# Altium project STM32F446_Nucleo_DSP_Backpack.PrjPcb
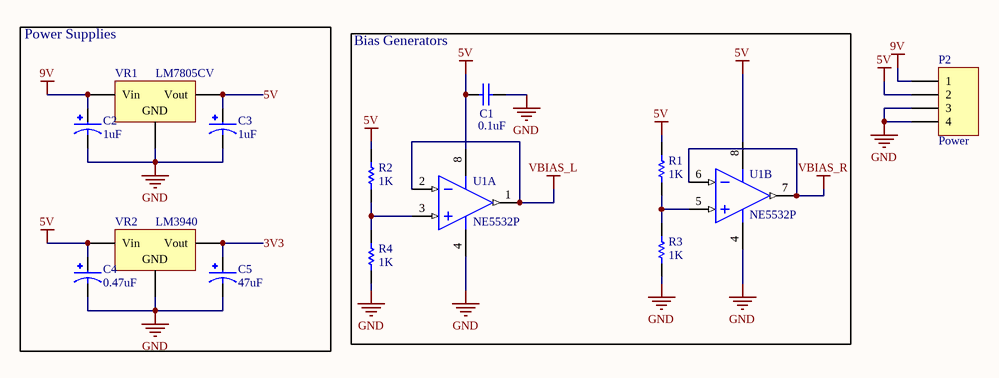
[diagram p0: Power.SchDoc]
3 sheets, 91 parts. Net scope: global (net labels, ports and power ports of the same name join across sheets).
Board file: PCB1.PcbDoc
Sheets:
  Power.SchDoc
  Volume_Tone_Control.SchDoc
  Digital.SchDoc

## Sheet Power.SchDoc
size Letter; SheetNumber: 1; SheetTotal: 3

### Parts
C1  value 0.1uF  [RAD-0.1]  (hidden comment: Cap)
C2  1uF  [CAPPRD200W50D500H1500]
C3  1uF  [CAPPRD200W50D500H1500]
C4  0.47uF  [CAPPRD200W50D500H1500]
C5  47uF  [CAPPRD200W50D500H1500]
P2  Power  [HDR1X4]
R1  value 1K  [AXIAL-0.3]  (hidden comment: Res1)
R2  value 1K  [AXIAL-0.3]  (hidden comment: Res1)
R3  value 1K  [AXIAL-0.3]  (hidden comment: Res1)
R4  value 1K  [AXIAL-0.3]  (hidden comment: Res1)
U1  NE5532P  [TI-P8]  (parts A,B of 2)
VR1  LM7805CV  [T03B]
VR2  LM3940  [T03B]

### Blocks framed on the sheet
Power Supplies: C2-C5 VR1 VR2
Bias Generators: C1 R1-R4 U1

### Nets
3V3: C5.P VR2.3(Vout)
5V: C1.1 C3.P C4.P P2.2 R1.2 R2.2 U1.8(VCC+) VR1.3(Vout) VR2.1(Vin)
9V: C2.P P2.1 VR1.1(Vin)
GND: C1.2 C2.N C3.N C4.N C5.N P2.3 P2.4 R3.1 R4.1 U1.4(VCC-) VR1.2(GND) VR2.2(GND)
VBIAS_L: U1.1(OUT1) U1.2(IN1-)
VBIAS_R: U1.6(IN2-) U1.7(OUT2)
NetR1_1: R1.1 R3.2 U1.5(IN2+)
NetR2_1: R2.1 R4.2 U1.3(IN1+)

### Library data of the parts
C1 = Cap: Capacitor; Published: 8-Jun-2000; LatestRevisionDate: 17-Jul-2002; LatestRevisionNote: Re-released for DXP Platform.; PackageReference: RAD-0.3; Publisher: Altium Limited; PackageDescription: Radial Cap, Thru-Hole; 2 Leads; 0.3 in Pin Spacing
C2-C5 = EEUEB1J1R0: 1F 63V Aluminum Electrolytic Capacitors Radial, Can 5000 Hrs @ 105C; MP: EEU-EB1J1R0; MF: Panasonic Electronic Components; Price: None; Value: *; Package: RADIAL-2 Panasonic; Check_prices: https://www.snapeda.com/parts/EEU-EB1J1R0/Panasonic/view-part/6221748/?ref=eda; SnapEDA_Link: https://www.snapeda.com/parts/EEU-EB1J1R0/Panasonic/view-part/6221748/?ref=snap; Availability: Not in stock
P2 = Header 4: Header, 4-Pin; LatestRevisionDate: 17-Jul-2002; LatestRevisionNote: Re-released for DXP Platform.; Publisher: Altium Limited
R1-R4 = Res1: Resistor; Published: 8-Jun-2000; LatestRevisionDate: 17-Jul-2002; LatestRevisionNote: Re-released for DXP Platform.; PackageReference: AXIAL-0.3; Publisher: Altium Limited; PackageDescription: Axial Device, Thru-Hole; 2 Leads; 0.3 in Pin Spacing
U1 = NE5532P: Dual Low-Noise High-Speed Audio Operational Amplifier, 10 to 30 V, 0 to 70 degC, 8-pin DIP (P8), Pb-Free (RoHS); Manufacturer: Texas Instruments; Slew Rate(Typ)(V/us): 9; CMRR(Min)(dB): 70; Sub Family: General Purpose Amplifier, High Supply Voltage Amplifier (>=30V), Low Noise Amp (<=10nV/rtHz); IIB(Max)(pA): 800000; GBW(Typ)(MHz): 10; Iq per channel(Max)(mA): 4; Number of Channels: 2; Vn at 1kHz(Typ)(nV/rtHz): 5; Total Supply Voltage(Max)(+5V is 5, +/-5V is 10): 30; Eco-Plan: Pb-Free (RoHS); PartNumber: NE5532P; ComponentLink1Description: Manufacturer URL; ComponentLink2Description: Datasheet; DatasheetVersion: SLOS075I; ComponentLink3URL: http://www.ti.com/litv/pdf/mpdi001b; ComponentLink1URL: http://www.ti.com/; Code_JEDEC: MS-001; Total Supply Voltage(Min)(+5V is 5, +/-5V is 10): 10; ComponentLink2URL: http://www.ti.com/lit/ds/symlink/ne5532.pdf; PackageReference: P8; ComponentLink3Description: Package Specification; Vio (25C)(Max)(mV): 4; PackageVersion: 4040082/E, 04/2010; Mounting Technology: Through Hole; PackageDescription: 8-Pin Plastic In-Line, Body 9.59 x 6.35 mm, Pitch 2.54 mm
VR1 VR2 = Volt Reg: Voltage Regulator; Published: 24-Mar-1999; LatestRevisionDate: 29-May-2009; LatestRevisionNote: IPC-7351 Footprint Added.; PackageReference: D2PAK; Publisher: Altium Limited; PackageDescription: 3-Pin Transistor Outline Package 2.54 mm Pitch, 15.1 mm Lead Span

## Sheet Volume_Tone_Control.SchDoc
size Letter; SheetNumber: 2; SheetTotal: 3
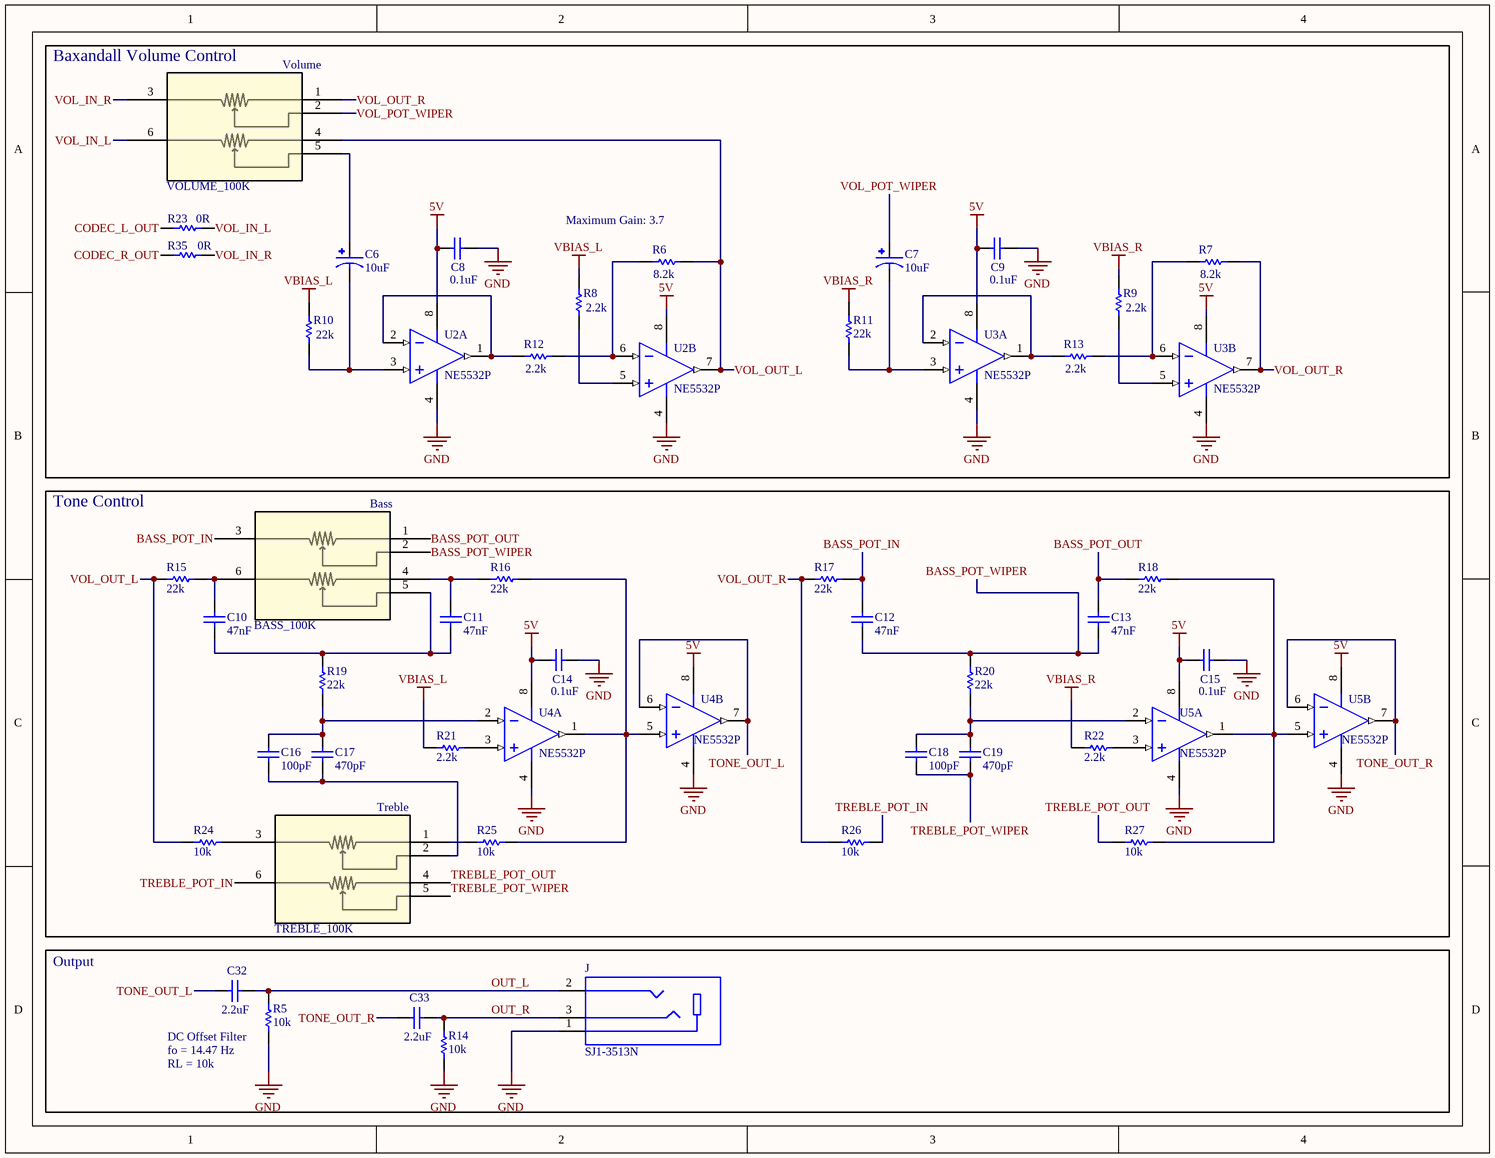
[diagram p1: Volume_Tone_Control.SchDoc]

### Parts
Bass  BASS_100K  [Bourns_PDB182-K425K-103A_0]
C6  10uF  [CAPPRD200W50D500H1500]
C7  10uF  [CAPPRD200W50D500H1500]
C8  value 0.1uF  [RAD-0.1]  (hidden comment: Cap)
C9  value 0.1uF  [RAD-0.1]  (hidden comment: Cap)
C10  value 47nF  [RAD-0.1]  (hidden comment: Cap)
C11  value 47nF  [RAD-0.1]  (hidden comment: Cap)
C12  value 47nF  [RAD-0.1]  (hidden comment: Cap)
C13  value 47nF  [RAD-0.1]  (hidden comment: Cap)
C14  value 0.1uF  [RAD-0.1]  (hidden comment: Cap)
C15  value 0.1uF  [RAD-0.1]  (hidden comment: Cap)
C16  value 100pF  [RAD-0.1]  (hidden comment: Cap)
C17  value 470pF  [RAD-0.1]  (hidden comment: Cap)
C18  value 100pF  [RAD-0.1]  (hidden comment: Cap)
C19  value 470pF  [RAD-0.1]  (hidden comment: Cap)
C32  value 2.2uF  [RAD-0.1]  (hidden comment: Cap)
C33  value 2.2uF  [RAD-0.1]  (hidden comment: Cap)
J  SJ1-3513N  [CUI_SJ1-3513N]
R5  value 10k  [AXIAL-0.3]  (hidden comment: Res1)
R6  value 8.2k  [AXIAL-0.3]  (hidden comment: Res1)
R7  value 8.2k  [AXIAL-0.3]  (hidden comment: Res1)
R8  value 2.2k  [AXIAL-0.3]  (hidden comment: Res1)
R9  value 2.2k  [AXIAL-0.3]  (hidden comment: Res1)
R10  value 22k  [AXIAL-0.3]  (hidden comment: Res1)
R11  value 22k  [AXIAL-0.3]  (hidden comment: Res1)
R12  value 2.2k  [AXIAL-0.3]  (hidden comment: Res1)
R13  value 2.2k  [AXIAL-0.3]  (hidden comment: Res1)
R14  value 10k  [AXIAL-0.3]  (hidden comment: Res1)
R15  value 22k  [AXIAL-0.3]  (hidden comment: Res1)
R16  value 22k  [AXIAL-0.3]  (hidden comment: Res1)
R17  value 22k  [AXIAL-0.3]  (hidden comment: Res1)
R18  value 22k  [AXIAL-0.3]  (hidden comment: Res1)
R19  value 22k  [AXIAL-0.3]  (hidden comment: Res1)
R20  value 22k  [AXIAL-0.3]  (hidden comment: Res1)
R21  value 2.2k  [AXIAL-0.3]  (hidden comment: Res1)
R22  value 2.2k  [AXIAL-0.3]  (hidden comment: Res1)
R23  value 0R  [AXIAL-0.3]  (hidden comment: Res1)
R24  value 10k  [AXIAL-0.3]  (hidden comment: Res1)
R25  value 10k  [AXIAL-0.3]  (hidden comment: Res1)
R26  value 10k  [AXIAL-0.3]  (hidden comment: Res1)
R27  value 10k  [AXIAL-0.3]  (hidden comment: Res1)
R35  value 0R  [AXIAL-0.3]  (hidden comment: Res1)
Treble  TREBLE_100K  [Bourns_PDB182-K425K-103A_0]
U2  NE5532P  [TI-P8]  (parts A,B of 2)
U3  NE5532P  [TI-P8]  (parts A,B of 2)
U4  NE5532P  [TI-P8]  (parts A,B of 2)
U5  NE5532P  [TI-P8]  (parts A,B of 2)
Volume  VOLUME_100K  [PDB-182-K_20K_BRN]

### Blocks framed on the sheet
Baxandall Volume Control: C6-C9 R6-R13 R23 R35 U2 U3 Volume
Tone Control: Bass C10-C19 R15-R22 R24-R27 Treble U4 U5
Output: C32 C33 J R5 R14

### Nets
5V: C8.1 C9.1 C14.1 C15.1 U2.8(VCC+) U3.8(VCC+) U4.8(VCC+) U5.8(VCC+)
GND: C8.2 C9.2 C14.2 C15.2 J.1 R5.2 R14.2 U2.4(VCC-) U3.4(VCC-) U4.4(VCC-) U5.4(VCC-)
VBIAS_L: R8.1 R10.1 R21.1
VBIAS_R: R9.1 R11.1 R22.1
BASS_POT_IN: Bass.3 C12.1 R17.2
BASS_POT_OUT: Bass.1 C13.1 R18.1
BASS_POT_WIPER: Bass.2 C12.2 C13.2 R20.2
CODEC_L_OUT: R23.1
CODEC_R_OUT: R35.1
OUT_L: C32.1 J.2 R5.1
OUT_R: C33.1 J.3 R14.1
TONE_OUT_L: C32.2 U4.6(IN2-) U4.7(OUT2)
TONE_OUT_R: C33.2 U5.6(IN2-) U5.7(OUT2)
TREBLE_POT_IN: R26.2 Treble.6
TREBLE_POT_OUT: R27.2 Treble.4
TREBLE_POT_WIPER: C18.1 C19.1 Treble.5
VOL_IN_L: R23.2 Volume.6
VOL_IN_R: R35.2 Volume.3
VOL_OUT_L: R6.2 R15.1 R24.1 U2.7(OUT2) Volume.4
VOL_OUT_R: R7.2 R17.1 R26.1 U3.7(OUT2) Volume.1
VOL_POT_WIPER: C7.P Volume.2
NetBass_4: Bass.4 C11.1 R16.1
NetBass_5: Bass.5 C10.2 C11.2 R19.2
NetBass_6: Bass.6 C10.1 R15.2
NetC6_N: C6.N R10.2 U2.3(IN1+)
NetC6_P: C6.P Volume.5
NetC7_N: C7.N R11.2 U3.3(IN1+)
NetC16_1: C16.1 C17.1 Treble.2
NetC16_2: C16.2 C17.2 R19.1 U4.2(IN1-)
NetC18_2: C18.2 C19.2 R20.1 U5.2(IN1-)
NetR6_1: R6.1 R12.2 U2.6(IN2-)
NetR7_1: R7.1 R13.2 U3.6(IN2-)
NetR8_2: R8.2 U2.5(IN2+)
NetR9_2: R9.2 U3.5(IN2+)
NetR12_1: R12.1 U2.1(OUT1) U2.2(IN1-)
NetR13_1: R13.1 U3.1(OUT1) U3.2(IN1-)
NetR16_2: R16.2 R25.1 U4.1(OUT1) U4.5(IN2+)
NetR18_2: R18.2 R27.1 U5.1(OUT1) U5.5(IN2+)
NetR21_2: R21.2 U4.3(IN1+)
NetR22_2: R22.2 U5.3(IN1+)
NetR24_2: R24.2 Treble.3
NetR25_2: R25.2 Treble.1

### Notes on the sheet
- (near R6) Maximum Gain: 3.7
- (near R5) DC Offset Filter
- (near R5) fo = 14.47 Hz
- RL = 10k

### Library data of the parts
Bass Treble Volume = PDB182-K420K-103A2: No Description Available; Mfr_Name: Bourns Electronics; Copyright: Copyright (C) 2022 Ultra Librarian. All rights reserved.; Manufacturer_Part_Number: PDB182-K420K-103A2; RefDes: RefDes; Type: DEV
C6 C7 = EEUFC1J101: Capacitor; Aluminum Electrolytic; Radial Al Electrolytic Cap; 100uF 63V; MF: Panasonic Electronic; MP: EEU-FC1J101; Package: RADIAL-2 Panasonic; Price: None; Check_prices: https://www.snapeda.com/parts/EEU-FC1J101/Panasonic%20Electronic%20Components/view-part/494707/?ref=eda; Value: *; SnapEDA_Link: https://www.snapeda.com/parts/EEU-FC1J101/Panasonic%20Electronic%20Components/view-part/494707/?ref=snap; Availability: In Stock
C8-C19 C32 C33 = Cap: Capacitor; Published: 8-Jun-2000; LatestRevisionDate: 17-Jul-2002; LatestRevisionNote: Re-released for DXP Platform.; PackageReference: RAD-0.3; Publisher: Altium Limited; PackageDescription: Radial Cap, Thru-Hole; 2 Leads; 0.3 in Pin Spacing
J = SJ1-3513N: 3.5 mm, Stereo, Right Angle, Through Hole, Audio Jack Connector; MF: CUI Devices; Package: None; CUI_purchase_URL: https://www.cuidevices.com/product/interconnect/connectors/audio-connectors/jacks/sj1-351xn-series?utm_source=snapeda.com&utm_medium=referral&utm_campaign=snapedaBOM; Value: *; Price: None; MP: SJ1-3513N; Availability: Unavailable; SnapEDA_Link: https://www.snapeda.com/parts/SJ1-3513N/CUI%20Devices/view-part/617507/?ref=snap
R5-R27 R35 = Res1: Resistor; Published: 8-Jun-2000; LatestRevisionDate: 17-Jul-2002; LatestRevisionNote: Re-released for DXP Platform.; PackageReference: AXIAL-0.3; Publisher: Altium Limited; PackageDescription: Axial Device, Thru-Hole; 2 Leads; 0.3 in Pin Spacing
U2-U5 = NE5532P: as U1 on sheet Power; Eco-Plan: Pb-Free (RoHS); PartNumber: NE5532P; ComponentLink1Description: Manufacturer URL; ComponentLink2Description: Datasheet; DatasheetVersion: SLOS075I; ComponentLink3URL: http://www.ti.com/litv/pdf/mpdi001b; ComponentLink1URL: http://www.ti.com/; Code_JEDEC: MS-001; Total Supply Voltage(Min)(+5V is 5, +/-5V is 10): 10; ComponentLink2URL: http://www.ti.com/lit/ds/symlink/ne5532.pdf; PackageReference: P8; ComponentLink3Description: Package Specification; Vio (25C)(Max)(mV): 4; PackageVersion: 4040082/E, 04/2010; Mounting Technology: Through Hole; PackageDescription: 8-Pin Plastic In-Line, Body 9.59 x 6.35 mm, Pitch 2.54 mm

## Sheet Digital.SchDoc
size Letter; SheetNumber: 3; SheetTotal: 3
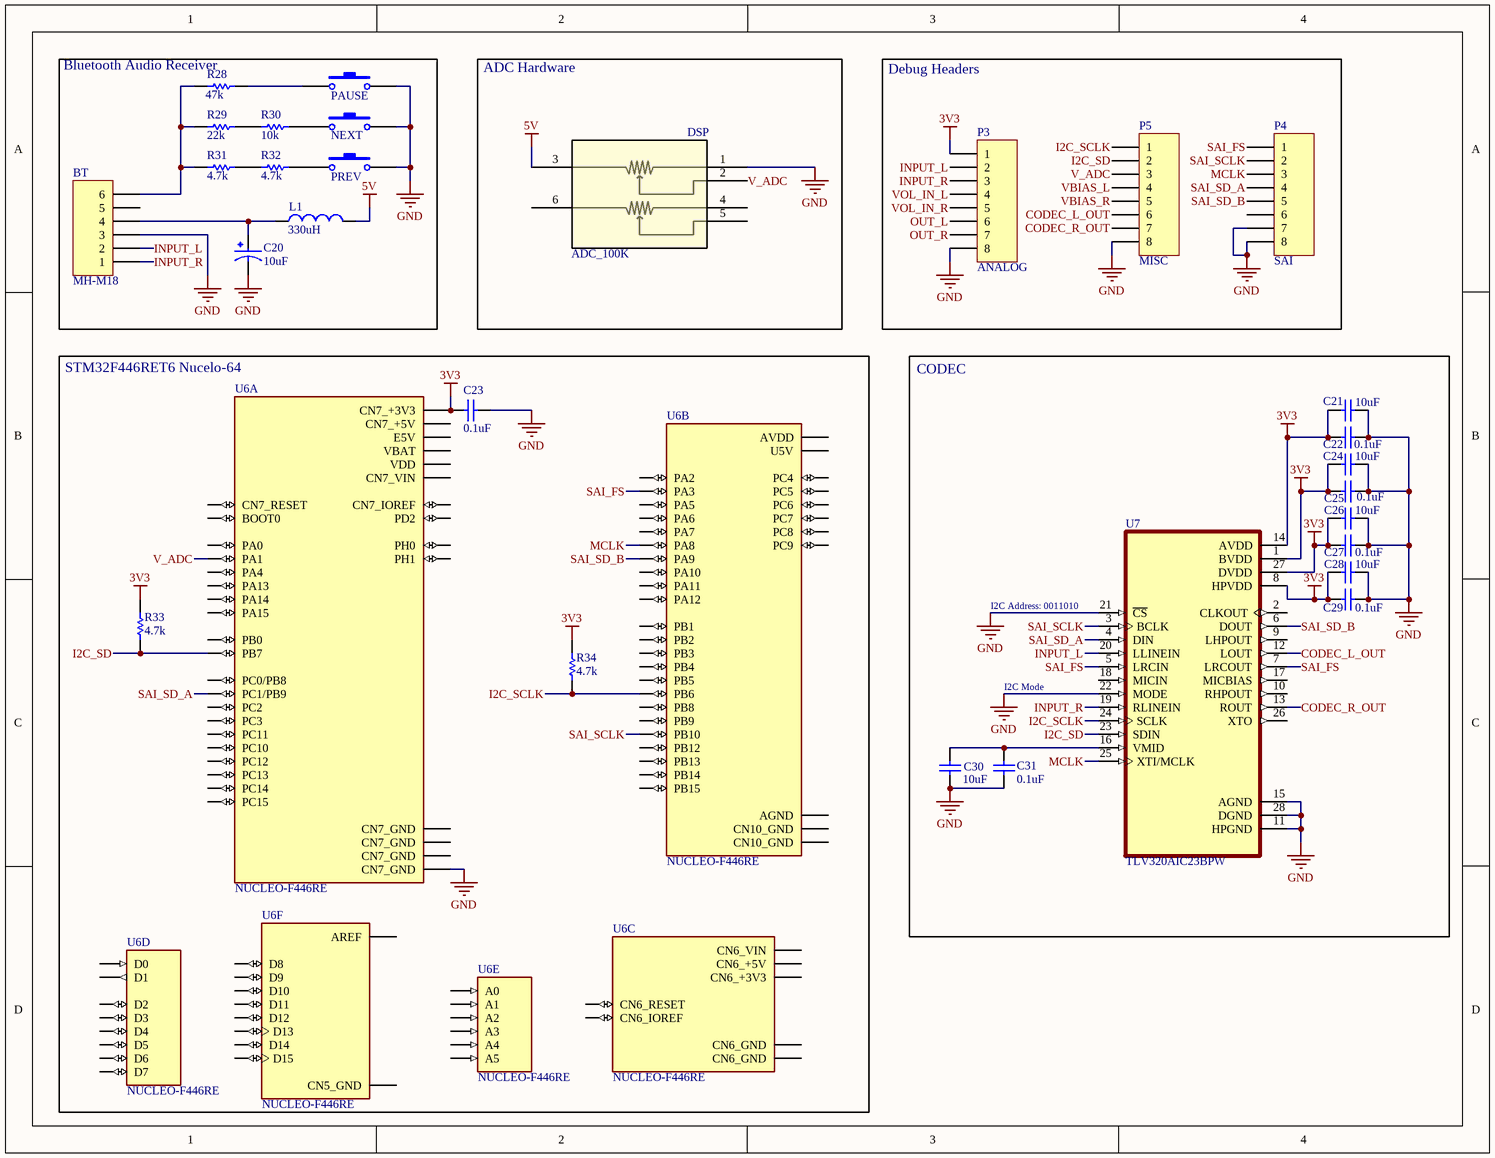
[diagram p2: Digital.SchDoc]

### Parts
BT  MH-M18  [HDR1X6]
C20  10uF  [CAPPRD200W50D500H1500]
C21  value 10uF  [RAD-0.1]  (hidden comment: Cap)
C22  value 0.1uF  [RAD-0.1]  (hidden comment: Cap)
C23  value 0.1uF  [RAD-0.1]  (hidden comment: Cap)
C24  value 10uF  [RAD-0.1]  (hidden comment: Cap)
C25  value 0.1uF  [RAD-0.1]  (hidden comment: Cap)
C26  value 10uF  [RAD-0.1]  (hidden comment: Cap)
C27  value 0.1uF  [RAD-0.1]  (hidden comment: Cap)
C28  value 10uF  [RAD-0.1]  (hidden comment: Cap)
C29  value 0.1uF  [RAD-0.1]  (hidden comment: Cap)
C30  value 10uF  [RAD-0.1]  (hidden comment: Cap)
C31  value 0.1uF  [RAD-0.1]  (hidden comment: Cap)
DSP  ADC_100K  [Bourns_PDB182-K425K-103A_0]
L1  value 330uH  [RAD-0.4]  (hidden comment: Inductor)
NEXT  NEXT  [SW PB]  (value not drawn)
P3  ANALOG  [HDR1X8]
P4  SAI  [HDR1X8]
P5  MISC  [HDR1X8]
PAUSE  PAUSE  [SW PB]  (value not drawn)
PREV  PREV  [SW PB]  (value not drawn)
R28  value 47k  [AXIAL-0.3]  (hidden comment: Res1)
R29  value 22k  [AXIAL-0.3]  (hidden comment: Res1)
R30  value 10k  [AXIAL-0.3]  (hidden comment: Res1)
R31  value 4.7k  [AXIAL-0.3]  (hidden comment: Res1)
R32  value 4.7k  [AXIAL-0.3]  (hidden comment: Res1)
R33  value 4.7k  [AXIAL-0.3]  (hidden comment: Res1)
R34  value 4.7k  [AXIAL-0.3]  (hidden comment: Res1)
U6  NUCLEO-F446RE  [MODULE_NUCLEO-F446RE]  (parts A,B,C,D,E,F of 6)
U7  TLV320AIC23BPW  [SOP65P640X120-28N]

### Blocks framed on the sheet
Bluetooth Audio Receiver: BT C20 L1 NEXT PAUSE PREV R28-R32
ADC Hardware: DSP
Debug Headers: P3-P5
STM32F446RET6 Nucelo-64: C23 R33 R34 U6
CODEC: C21 C22 C24-C31 U7

### Nets
3V3: C21.1 C22.1 C23.1 C24.1 C25.1 C26.1 C27.2 C28.1 C29.2 P3.1 R33.2 R34.2 U6.CN7_16(CN7_+3V3) U7.1(BVDD) U7.8(HPVDD) U7.14(AVDD) U7.27(DVDD)
5V: DSP.3 L1.2
GND: BT.3 C20.N C21.2 C22.2 C23.2 C24.2 C25.2 C26.2 C27.1 C28.2 C29.1 C30.1 C31.1 DSP.1 NEXT.2 P3.8 P4.7 P4.8 P5.8 PAUSE.2 PREV.2 U6.CN7_22(CN7_GND) U7.11(HPGND) U7.15(AGND) U7.21(~{CS}) U7.22(MODE) U7.28(DGND)
VBIAS_L: P5.4
VBIAS_R: P5.5
CODEC_L_OUT: P5.6 U7.12(LOUT)
CODEC_R_OUT: P5.7 U7.13(ROUT)
I2C_SCLK: P5.1 R34.1 U6.CN10_17(PB6) U7.24(SCLK)
I2C_SD: P5.2 R33.1 U6.CN7_21(PB7) U7.23(SDIN)
INPUT_L: BT.2 P3.2 U7.20(LLINEIN)
INPUT_R: BT.1 P3.3 U7.19(RLINEIN)
MCLK: P4.3 U6.CN10_23(PA8) U7.25(XTI/MCLK)
OUT_L: P3.6
OUT_R: P3.7
SAI_FS: P4.1 U6.CN10_37(PA3) U7.5(LRCIN) U7.7(LRCOUT)
SAI_SCLK: P4.2 U6.CN10_25(PB10) U7.3(BCLK)
SAI_SD_A: P4.4 U6.CN7_36(PC1/PB9) U7.4(DIN)
SAI_SD_B: P4.5 U6.CN10_21(PA9) U7.6(DOUT)
V_ADC: DSP.2 P5.3 U6.CN7_30(PA1)
VOL_IN_L: P3.4
VOL_IN_R: P3.5
NetBT_4: BT.4 C20.P L1.1
NetBT_6: BT.6 R28.1 R29.1 R31.1
NetC30_2: C30.2 C31.2 U7.16(VMID)
NetNEXT_1: NEXT.1 R30.2
NetPAUSE_1: PAUSE.1 R28.2
NetPREV_1: PREV.1 R32.2
NetR29_2: R29.2 R30.1
NetR31_2: R31.2 R32.1

Not connected (* = marked no-connect by the designer): BT 5; DSP 4(6) 5 6(4); P4 6; U6 CN5_1(D8) CN5_2(D9) CN5_3(D10) CN5_4(D11) CN5_5(D12) CN5_6(D13) CN5_7(CN5_GND) CN5_8(AREF) CN5_9(D14) CN5_10(D15) CN6_2(CN6_IOREF) CN6_3(CN6_RESET) CN6_4(CN6_+3V3) CN6_5(CN6_+5V) CN6_6(CN6_GND) CN6_7(CN6_GND) CN6_8(CN6_VIN) CN7_1(PC10) CN7_2(PC11) CN7_3(PC12) CN7_4(PD2) CN7_5(VDD) CN7_6(E5V) CN7_7(BOOT0) CN7_8(CN7_GND) CN7_12(CN7_IOREF) CN7_13(PA13) CN7_14(CN7_RESET) CN7_15(PA14) CN7_17(PA15) CN7_18(CN7_+5V) CN7_19(CN7_GND) CN7_20(CN7_GND) CN7_23(PC13) CN7_24(CN7_VIN) CN7_25(PC14) CN7_27(PC15) CN7_28(PA0) CN7_29(PH0) CN7_31(PH1) CN7_32(PA4) CN7_33(VBAT) CN7_34(PB0) CN7_35(PC2) CN7_37(PC3) CN7_38(PC0/PB8) CN8_1(A0) CN8_2(A1) CN8_3(A2) CN8_4(A3) CN8_5(A4) CN8_6(A5) CN9_1(D0) CN9_2(D1) CN9_3(D2) CN9_4(D3) CN9_5(D4) CN9_6(D5) CN9_7(D6) CN9_8(D7) CN10_1(PC9) CN10_2(PC8) CN10_3(PB8) CN10_4(PC6) CN10_5(PB9) CN10_6(PC5) CN10_7(AVDD) CN10_8(U5V) CN10_9(CN10_GND) CN10_11(PA5) CN10_12(PA12) CN10_13(PA6) CN10_14(PA11) CN10_15(PA7) CN10_16(PB12) CN10_19(PC7) CN10_20(CN10_GND) CN10_22(PB2) CN10_24(PB1) CN10_26(PB15) CN10_27(PB4) CN10_28(PB14) CN10_29(PB5) CN10_30(PB13) CN10_31(PB3) CN10_32(AGND) CN10_33(PA10) CN10_34(PC4) CN10_35(PA2); U7 2(CLKOUT) 9(LHPOUT) 10(RHPOUT) 17(MICBIAS) 18(MICIN) 26(XTO)

### Notes on the sheet
- (near U7) I2C Address: 0011010
- I2C Mode

### Library data of the parts
BT = Header 6: Header, 6-Pin; LatestRevisionDate: 17-Jul-2002; LatestRevisionNote: Re-released for DXP Platform.; Publisher: Altium Limited
C20 = EEUFC1J101: as C6 on sheet Volume_Tone_Control; Package: RADIAL-2 Panasonic; Price: None; Check_prices: https://www.snapeda.com/parts/EEU-FC1J101/Panasonic%20Electronic%20Components/view-part/494707/?ref=eda; Value: *; SnapEDA_Link: https://www.snapeda.com/parts/EEU-FC1J101/Panasonic%20Electronic%20Components/view-part/494707/?ref=snap; Availability: In Stock
C21-C31 = Cap: Capacitor; Published: 8-Jun-2000; LatestRevisionDate: 17-Jul-2002; LatestRevisionNote: Re-released for DXP Platform.; PackageReference: RAD-0.3; Publisher: Altium Limited; PackageDescription: Radial Cap, Thru-Hole; 2 Leads; 0.3 in Pin Spacing
DSP = PDB182-K420K-103A2: as Bass on sheet Volume_Tone_Control; Copyright: Copyright (C) 2022 Ultra Librarian. All rights reserved.; Manufacturer_Part_Number: PDB182-K420K-103A2; RefDes: RefDes; Type: DEV
L1 = Inductor: Code_IEC: 1005; Published: 8-Jun-2000; LatestRevisionDate: 29-May-2009; LatestRevisionNote: IPC-7351 Footprint Added.; PackageReference: 0402-A; Publisher: Altium Limited; PackageDescription: Chip Inductor; Code_JEITA: 0402
NEXT PAUSE PREV = SW-PB: Switch; Published: 24-Mar-1999; LatestRevisionDate: 17-Jul-2002; LatestRevisionNote: Re-released for DXP Platform.; PackageReference: SPST-2; Publisher: Altium Limited; PackageDescription: Switch; 2 Leads
P3-P5 = Header 8: Header, 8-Pin; LatestRevisionDate: 17-Jul-2002; LatestRevisionNote: Re-released for DXP Platform.; Publisher: Altium Limited
R28-R34 = Res1: Resistor; Published: 8-Jun-2000; LatestRevisionDate: 17-Jul-2002; LatestRevisionNote: Re-released for DXP Platform.; PackageReference: AXIAL-0.3; Publisher: Altium Limited; PackageDescription: Axial Device, Thru-Hole; 2 Leads; 0.3 in Pin Spacing
U6 = NUCLEO-F446RE: STM32 Nucleo-64 development board with STM32F446RET6 MCU, supports Arduino and ST morpho connectivity; Price: None; MP: NUCLEO-F446RE; Value: *; Availability: Unavailable; Package: None
U7 = TLV320AIC23BPW: Low-Power Stereo CODEC with HP Amplifier 28-TSSOP -10 to 70; MF: Texas Instruments; Availability: Warning; Package: TSSOP-28 Texas Instruments; MP: TLV320AIC23BPW; Texas_Instruments-Purchase-URL: https://snapeda.com/shop?store=Texas+Instruments&id=249064; DigiKey-Purchase-URL: https://snapeda.com/shop?store=DigiKey&id=249064; Value: *; Arrow_Electronics-Purchase-URL: https://snapeda.com/shop?store=Arrow+Electronics&id=249064; Mouser-Purchase-URL: https://snapeda.com/shop?store=Mouser&id=249064; Price: None; SnapEDA_Link: https://www.snapeda.com/parts/TLV320AIC23BPW/Texas%20Instruments/view-part/249064/?ref=snap

## Nets that join several sheets
3V3: Power (C5.P VR2.3), Digital (17 pins)
5V: Power (9 pins), Volume_Tone_Control (8 pins), Digital (DSP.3 L1.2)
GND: Power (12 pins), Volume_Tone_Control (11 pins), Digital (27 pins)
VBIAS_L: Power (U1.1 U1.2), Volume_Tone_Control (R8.1 R10.1 R21.1), Digital (P5.4)
VBIAS_R: Power (U1.6 U1.7), Volume_Tone_Control (R9.1 R11.1 R22.1), Digital (P5.5)
CODEC_L_OUT: Volume_Tone_Control (R23.1), Digital (P5.6 U7.12)
CODEC_R_OUT: Volume_Tone_Control (R35.1), Digital (P5.7 U7.13)
OUT_L: Volume_Tone_Control (C32.1 J.2 R5.1), Digital (P3.6)
OUT_R: Volume_Tone_Control (C33.1 J.3 R14.1), Digital (P3.7)
VOL_IN_L: Volume_Tone_Control (R23.2 Volume.6), Digital (P3.4)
VOL_IN_R: Volume_Tone_Control (R35.2 Volume.3), Digital (P3.5)